# EAGLE design motherboard (EAGLE 9.1.3)
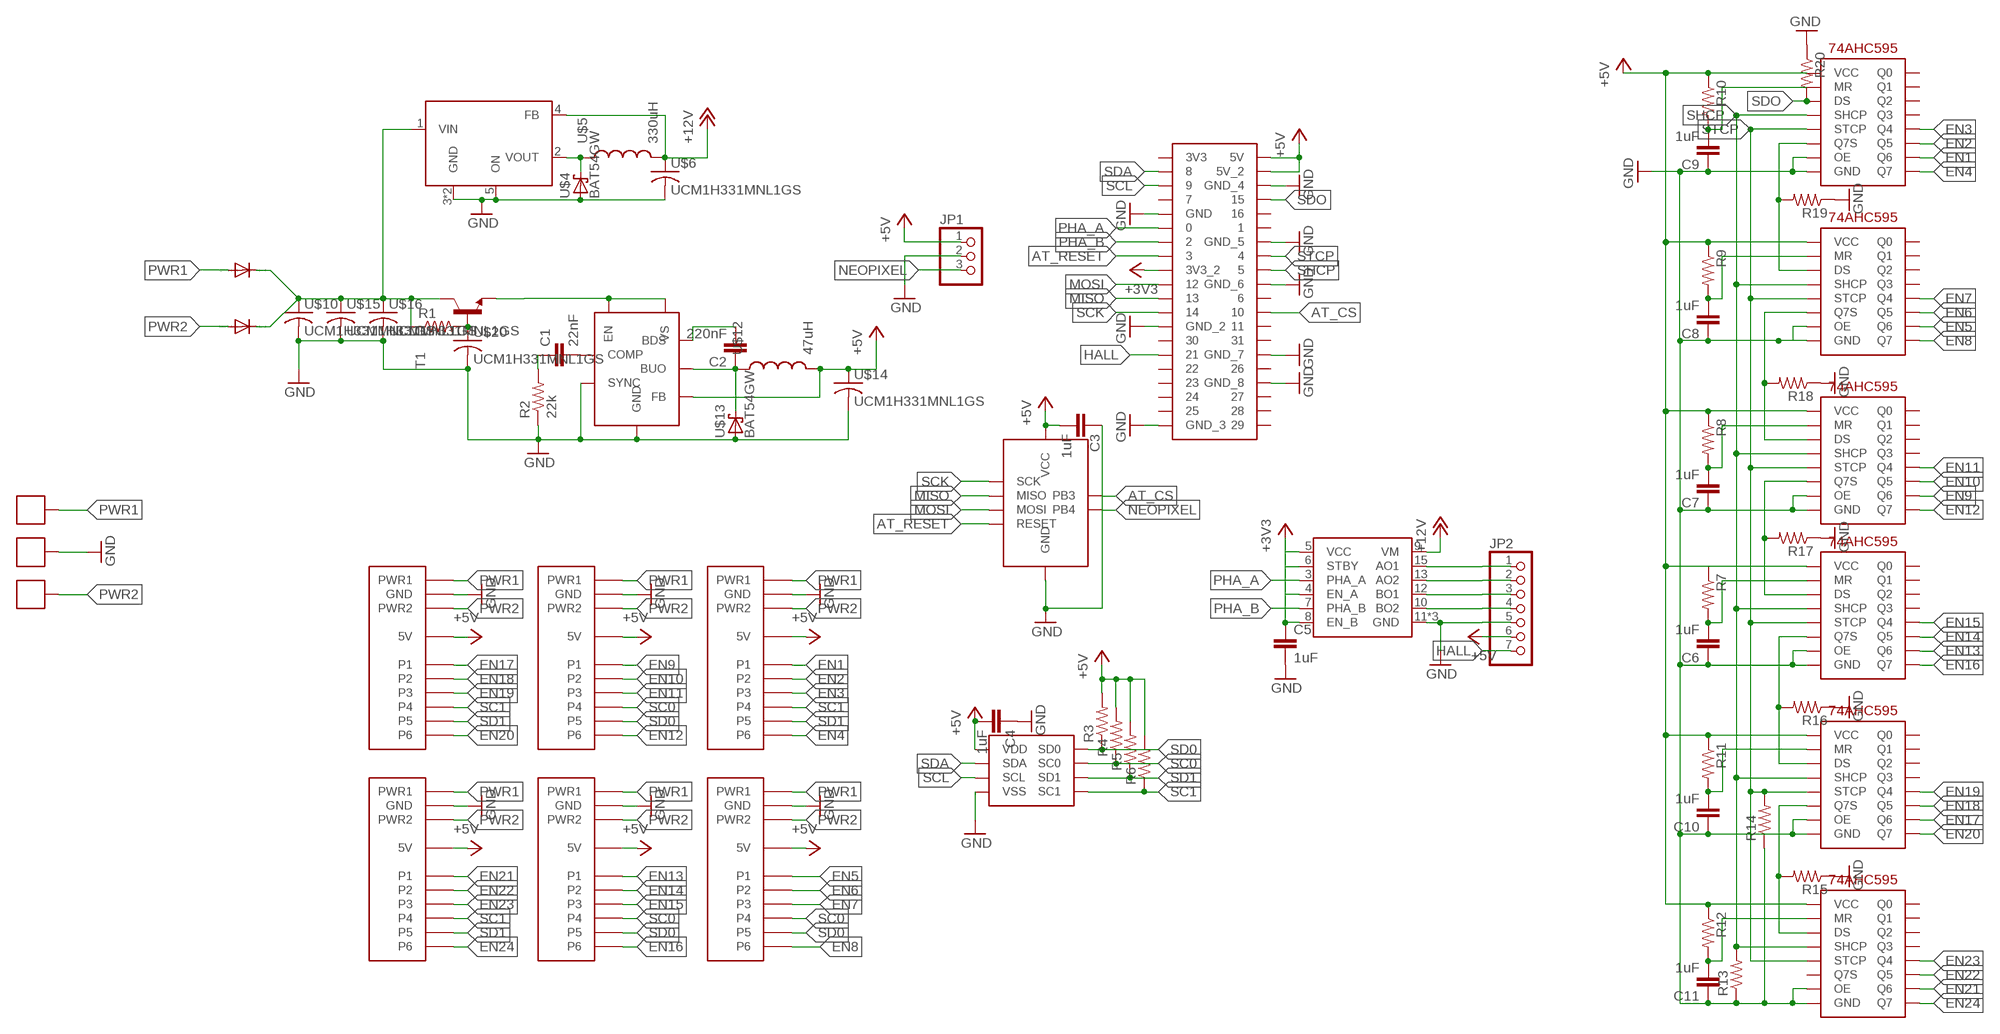
[diagram p0: schematic, sheet 1]

## Parts
B1  PCIE_SOCKET  [PCIE_SOCKET]
B2  PCIE_SOCKET  [PCIE_SOCKET]
B3  PCIE_SOCKET  [PCIE_SOCKET]
B4  PCIE_SOCKET  [PCIE_SOCKET]
B5  PCIE_SOCKET  [PCIE_SOCKET]
B6  PCIE_SOCKET  [PCIE_SOCKET]
C1  22nF  C-EUC0805  [C0805]
C2  220nF  C-EUC0805  [C0805]
C3  1uF  C-EUC0805  [C0805]
C4  1uF  C-EUC0805  [C0805]
C5  1uF  C-EUC0805  [C0805]
C6  1uF  C-EUC0805  [C0805]
C7  1uF  C-EUC0805  [C0805]
C8  1uF  C-EUC0805  [C0805]
C9  1uF  C-EUC0805  [C0805]
C10  1uF  C-EUC0805  [C0805]
C11  1uF  C-EUC0805  [C0805]
JP1  PINHD-1X3  [1X03]
JP2  PINHD-1X7  [1X07]
R1  R-US_R1206  [R1206]
R2  22k  R-US_R1206  [R1206]
R3  R-US_R0805  [R0805]
R4  R-US_R0805  [R0805]
R5  R-US_R0805  [R0805]
R6  R-US_R0805  [R0805]
R7  R-US_R0805  [R0805]
R8  R-US_R0805  [R0805]
R9  R-US_R0805  [R0805]
R10  R-US_R0805  [R0805]
R11  R-US_R0805  [R0805]
R12  R-US_R0805  [R0805]
R13  R-US_R0805  [R0805]
R14  R-US_R0805  [R0805]
R15  R-US_R0805  [R0805]
R16  R-US_R0805  [R0805]
R17  R-US_R0805  [R0805]
R18  R-US_R0805  [R0805]
R19  R-US_R0805  [R0805]
R20  R-US_R0805  [R0805]
T1  -NPN-SOT23-EBC  [SOT23-EBC]
U1  IFX91041EJV50XUMA1  [SOIC127P600X170-8]
U$1  RPI_SOCKET  [40PIN_SOCKET]
U$2  TC78H620FNG  [SSOP16]
U$3  TL2575HV-12IKTTR  [TO170P1524X483-6]
U$4  BAT54GW  [SOD3616X130]
U$5  330uH  SRN8040TA  [SRN8040TA]
U$6  UCM1H331MNL1GS  [CAPAE1030X1050]
U$7  74HC595_QFN  [QFN50P250X350X100-16]
U$8  BAS16GW  [SOD3616X130]
U$9  BAS16GW  [SOD3616X130]
U$10  UCM1H331MNL1GS  [CAPAE1030X1050]
U$11  ATTINY85  [SOIC127P599X175-8]
U$12  47uH  SRN8040TA  [SRN8040TA]
U$13  BAT54GW  [SOD3616X130]
U$14  UCM1H331MNL1GS  [CAPAE1030X1050]
U$15  UCM1H331MNL1GS  [CAPAE1030X1050]
U$16  UCM1H331MNL1GS  [CAPAE1030X1050]
U$17  1935310  [1935310]
U$18  1935310  [1935310]
U$19  1935310  [1935310]
U$20  UCM1H331MNL1GS  [CAPAE1030X1050]
U$21  PCA9540BDP  [TSSOP8]
U$22  74HC595_QFN  [QFN50P250X350X100-16]
U$23  74HC595_QFN  [QFN50P250X350X100-16]
U$24  74HC595_QFN  [QFN50P250X350X100-16]
U$25  74HC595_QFN  [QFN50P250X350X100-16]
U$26  74HC595_QFN  [QFN50P250X350X100-16]

## Nets
+3V3: C5.1 U$1.P17(3V3_2) U$2.4(EN_A) U$2.5(VCC) U$2.6(STBY) U$2.8(EN_B)
+5V: B1.5V_1(5V) B1.5V_2(5V) B2.5V_1(5V) B2.5V_2(5V) B3.5V_1(5V) B3.5V_2(5V) B4.5V_1(5V) B4.5V_2(5V) B5.5V_1(5V) B5.5V_2(5V) B6.5V_1(5V) B6.5V_2(5V) C3.2 C4.2 JP1.1 JP2.6 R3.2 R4.2 R5.2 R6.2 R7.1 R8.1 R9.1 R10.1 R11.1 R12.1 U1.4(FB) U$1.P2(5V) U$1.P4(5V_2) U$7.P16(VCC) U$11.8(VCC) U$12.P$2 U$14.1 U$21.3(VDD) U$22.P16(VCC) U$23.P16(VCC) U$24.P16(VCC) U$25.P16(VCC) U$26.P16(VCC)
+12V: U$2.9(VM) U$3.4(FB) U$5.P$2 U$6.1
AT_CS: U$1.P24 U$11.2(PB3)
AT_RESET: U$1.P15 U$11.1(RESET)
EN1: B1.P1 U$7.P6(Q6)
EN2: B1.P2 U$7.P5(Q5)
EN3: B1.P3 U$7.P4(Q4)
EN4: B1.P6 U$7.P7(Q7)
EN5: B2.P1 U$22.P6(Q6)
EN6: B2.P2 U$22.P5(Q5)
EN7: B2.P3 U$22.P4(Q4)
EN8: B2.P6 U$22.P7(Q7)
EN9: B3.P1 U$23.P6(Q6)
EN10: B3.P2 U$23.P5(Q5)
EN11: B3.P3 U$23.P4(Q4)
EN12: B3.P6 U$23.P7(Q7)
EN13: B4.P1 U$24.P6(Q6)
EN14: B4.P2 U$24.P5(Q5)
EN15: B4.P3 U$24.P4(Q4)
EN16: B4.P6 U$24.P7(Q7)
EN17: B5.P1 U$25.P6(Q6)
EN18: B5.P2 U$25.P5(Q5)
EN19: B5.P3 U$25.P4(Q4)
EN20: B5.P6 U$25.P7(Q7)
EN21: B6.P1 U$26.P6(Q6)
EN22: B6.P2 U$26.P5(Q5)
EN23: B6.P3 U$26.P4(Q4)
EN24: B6.P6 U$26.P7(Q7)
GND: B1.GND1(GND) B1.GND2(GND) B2.GND1(GND) B2.GND2(GND) B3.GND1(GND) B3.GND2(GND) B4.GND1(GND) B4.GND2(GND) B5.GND1(GND) B5.GND2(GND) B6.GND1(GND) B6.GND2(GND) C3.1 C4.1 C5.2 C6.1 C7.1 C8.1 C9.1 C10.1 C11.1 JP1.2 JP2.5 R2.1 R13.1 R14.1 R15.1 R16.1 R17.1 R18.1 R19.1 R20.1 U1.1(SYNC) U1.2(GND) U1.PAD(GND) U$1.P6(GND_4) U$1.P9(GND) U$1.P14(GND_5) U$1.P20(GND_6) U$1.P25(GND_2) U$1.P30(GND_7) U$1.P34(GND_8) U$1.P39(GND_3) U$2.11(GND) U$2.14(GND) U$2.16(GND) U$3.3(GND) U$3.5(ON) U$3.6(GND) U$4.2(A) U$6.2 U$7.P8(GND) U$7.P13(OE) U$7.P$1(GND) U$10.2 U$11.4(GND) U$13.2(A) U$14.2 U$15.2 U$16.2 U$18.P$1 U$18.P$2 U$20.2 U$21.6(VSS) U$22.P8(GND) U$22.P13(OE) U$22.P$1(GND) U$23.P8(GND) U$23.P13(OE) U$23.P$1(GND) U$24.P8(GND) U$24.P13(OE) U$24.P$1(GND) U$25.P8(GND) U$25.P13(OE) U$25.P$1(GND) U$26.P8(GND) U$26.P13(OE) U$26.P$1(GND)
HALL: JP2.7 U$1.P29
MISO: U$1.P21 U$11.6(MISO)
MOSI: U$1.P19 U$11.5(MOSI)
N$1: T1.E U1.7(EN) U1.8(VS)
N$2: R1.2 T1.B U$20.1
N$3: R1.1 T1.C U$3.1(VIN) U$8.1(C) U$9.1(C) U$10.1 U$15.1 U$16.1
N$4: C1.2 U1.3(COMP)
N$5: C1.1 R2.2
N$6: C2.2 U1.5(BDS)
N$7: C2.1 U1.6(BUO) U$12.P$1 U$13.1(C)
N$8: R19.2 U$7.P9(Q7S) U$22.P14(DS)
N$9: JP2.1 U$2.15(AO1)
N$10: JP2.2 U$2.13(AO2)
N$11: JP2.3 U$2.12(BO1)
N$12: JP2.4 U$2.10(BO2)
N$13: U$3.2(VOUT) U$4.1(C) U$5.P$1
N$14: C6.2 R7.2 U$24.P10(MR)
N$15: R18.2 U$22.P9(Q7S) U$23.P14(DS)
N$16: R17.2 U$23.P9(Q7S) U$24.P14(DS)
N$17: C7.2 R8.2 U$23.P10(MR)
N$18: C8.2 R9.2 U$22.P10(MR)
N$19: C9.2 R10.2 U$7.P10(MR)
N$20: R16.2 U$24.P9(Q7S) U$25.P14(DS)
N$21: C10.2 R11.2 U$25.P10(MR)
N$23: C11.2 R12.2 U$26.P10(MR)
N$24: R15.2 U$25.P9(Q7S) U$26.P14(DS)
NEOPIXEL: JP1.3 U$11.3(PB4)
PHA_A: U$1.P11 U$2.3(PHA_A)
PHA_B: U$1.P13 U$2.7(PHA_B)
PWR1: B1.PWR1_1(PWR1) B1.PWR1_2(PWR1) B2.PWR1_1(PWR1) B2.PWR1_2(PWR1) B3.PWR1_1(PWR1) B3.PWR1_2(PWR1) B4.PWR1_1(PWR1) B4.PWR1_2(PWR1) B5.PWR1_1(PWR1) B5.PWR1_2(PWR1) B6.PWR1_1(PWR1) B6.PWR1_2(PWR1) U$8.2(A) U$17.P$1 U$17.P$2
PWR2: B1.PWR2_1(PWR2) B1.PWR2_2(PWR2) B2.PWR2_1(PWR2) B2.PWR2_2(PWR2) B3.PWR2_1(PWR2) B3.PWR2_2(PWR2) B4.PWR2_1(PWR2) B4.PWR2_2(PWR2) B5.PWR2_1(PWR2) B5.PWR2_2(PWR2) B6.PWR2_1(PWR2) B6.PWR2_2(PWR2) U$9.2(A) U$19.P$1 U$19.P$2
SC0: B2.P4 B3.P4 B4.P4 R4.1 U$21.5(SC0)
SC1: B1.P4 B5.P4 B6.P4 R6.1 U$21.8(SC1)
SCK: U$1.P23 U$11.7(SCK)
SCL: U$1.P5 U$21.1(SCL)
SD0: B2.P5 B3.P5 B4.P5 R3.1 U$21.4(SD0)
SD1: B1.P5 B5.P5 B6.P5 R5.1 U$21.7(SD1)
SDA: U$1.P3 U$21.2(SDA)
SDO: R20.2 U$1.P8 U$7.P14(DS)
SHCP: R13.2 U$1.P18 U$7.P11(SHCP) U$22.P11(SHCP) U$23.P11(SHCP) U$24.P11(SHCP) U$25.P11(SHCP) U$26.P11(SHCP)
STCP: R14.2 U$1.P16 U$7.P12(STCP) U$22.P12(STCP) U$23.P12(STCP) U$24.P12(STCP) U$25.P12(STCP) U$26.P12(STCP)
Unconnected: U$1.P1(3V3) U$1.P7 U$1.P10 U$1.P12 U$1.P22 U$1.P26 U$1.P27 U$1.P28 U$1.P31 U$1.P32 U$1.P33 U$1.P35 U$1.P36 U$1.P37 U$1.P38 U$1.P40 U$7.P1(Q1) U$7.P2(Q2) U$7.P3(Q3) U$7.P15(Q0) U$22.P1(Q1) U$22.P2(Q2) U$22.P3(Q3) U$22.P15(Q0) U$23.P1(Q1) U$23.P2(Q2) U$23.P3(Q3) U$23.P15(Q0) U$24.P1(Q1) U$24.P2(Q2) U$24.P3(Q3) U$24.P15(Q0) U$25.P1(Q1) U$25.P2(Q2) U$25.P3(Q3) U$25.P15(Q0) U$26.P1(Q1) U$26.P2(Q2) U$26.P3(Q3) U$26.P9(Q7S) U$26.P15(Q0)

## Library data of the parts
B1-B6 = tide_clock:PCIE_SOCKET
C1-C11 = resistor:C-EU: CAPACITOR, European symbol
JP1 = pinhead:PINHD-1X3: PIN HEADER
JP2 = pinhead:PINHD-1X7: PIN HEADER
R1-R20 = resistor:R-US_: RESISTOR, American symbol
T1 = transistor:*-NPN-: NPN Transistror BF959 corrected 2008.03.06
U1 = tide_clock:IFX91041EJV50XUMA1
U$1 = tide_clock:RPI_SOCKET
U$2 = tide_clock:TC78H620FNG
U$3 = tide_clock:TL2575HV-12IKTTR
U$4 U$13 = tide_clock:BAT54GW
U$5 U$12 = tide_clock:SRN8040TA
U$6 U$10 U$14-U$16 U$20 = tide_clock:UCM1H331MNL1GS
U$7 U$22-U$26 = tide_clock:74HC595_QFN
U$8 U$9 = tide_clock:BAS16GW
U$11 = tide_clock:ATTINY85
U$17-U$19 = tide_clock:1935310
U$21 = tide_clock:PCA9540BDP

## Board
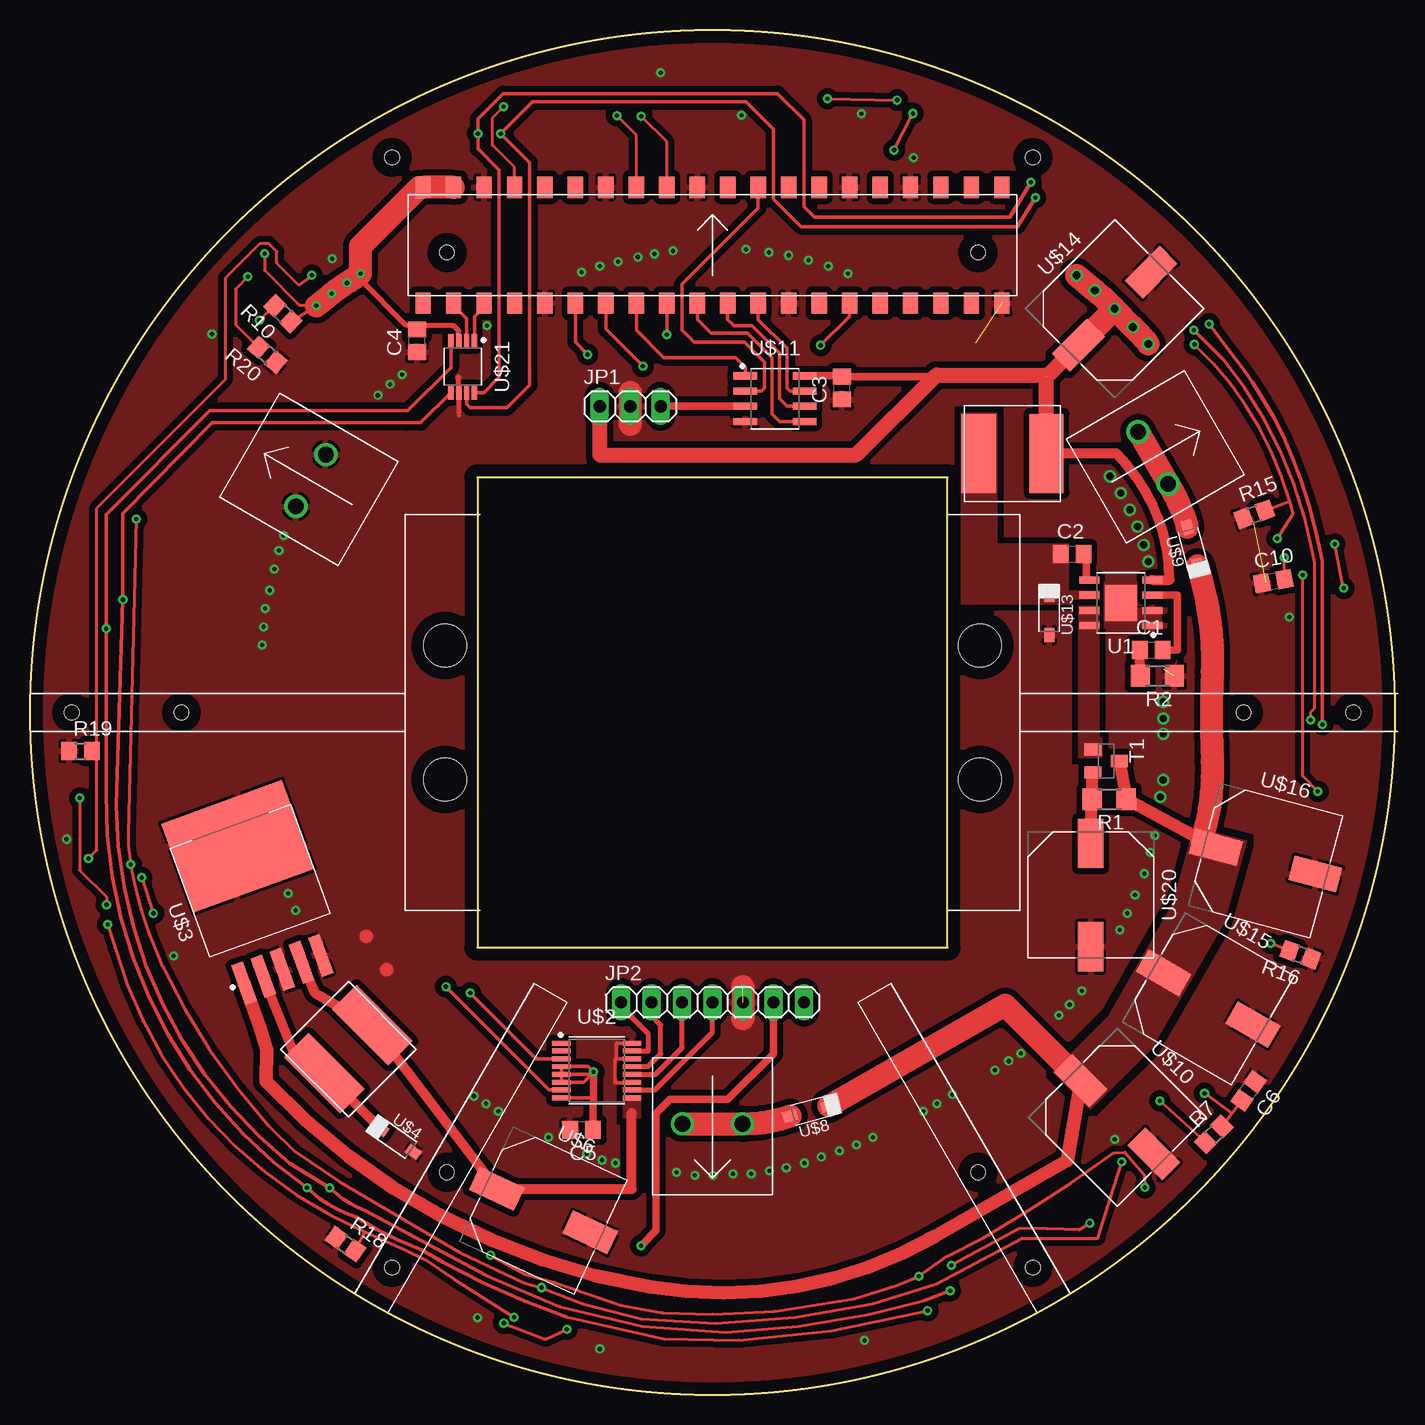
[diagram p1: board, top side]
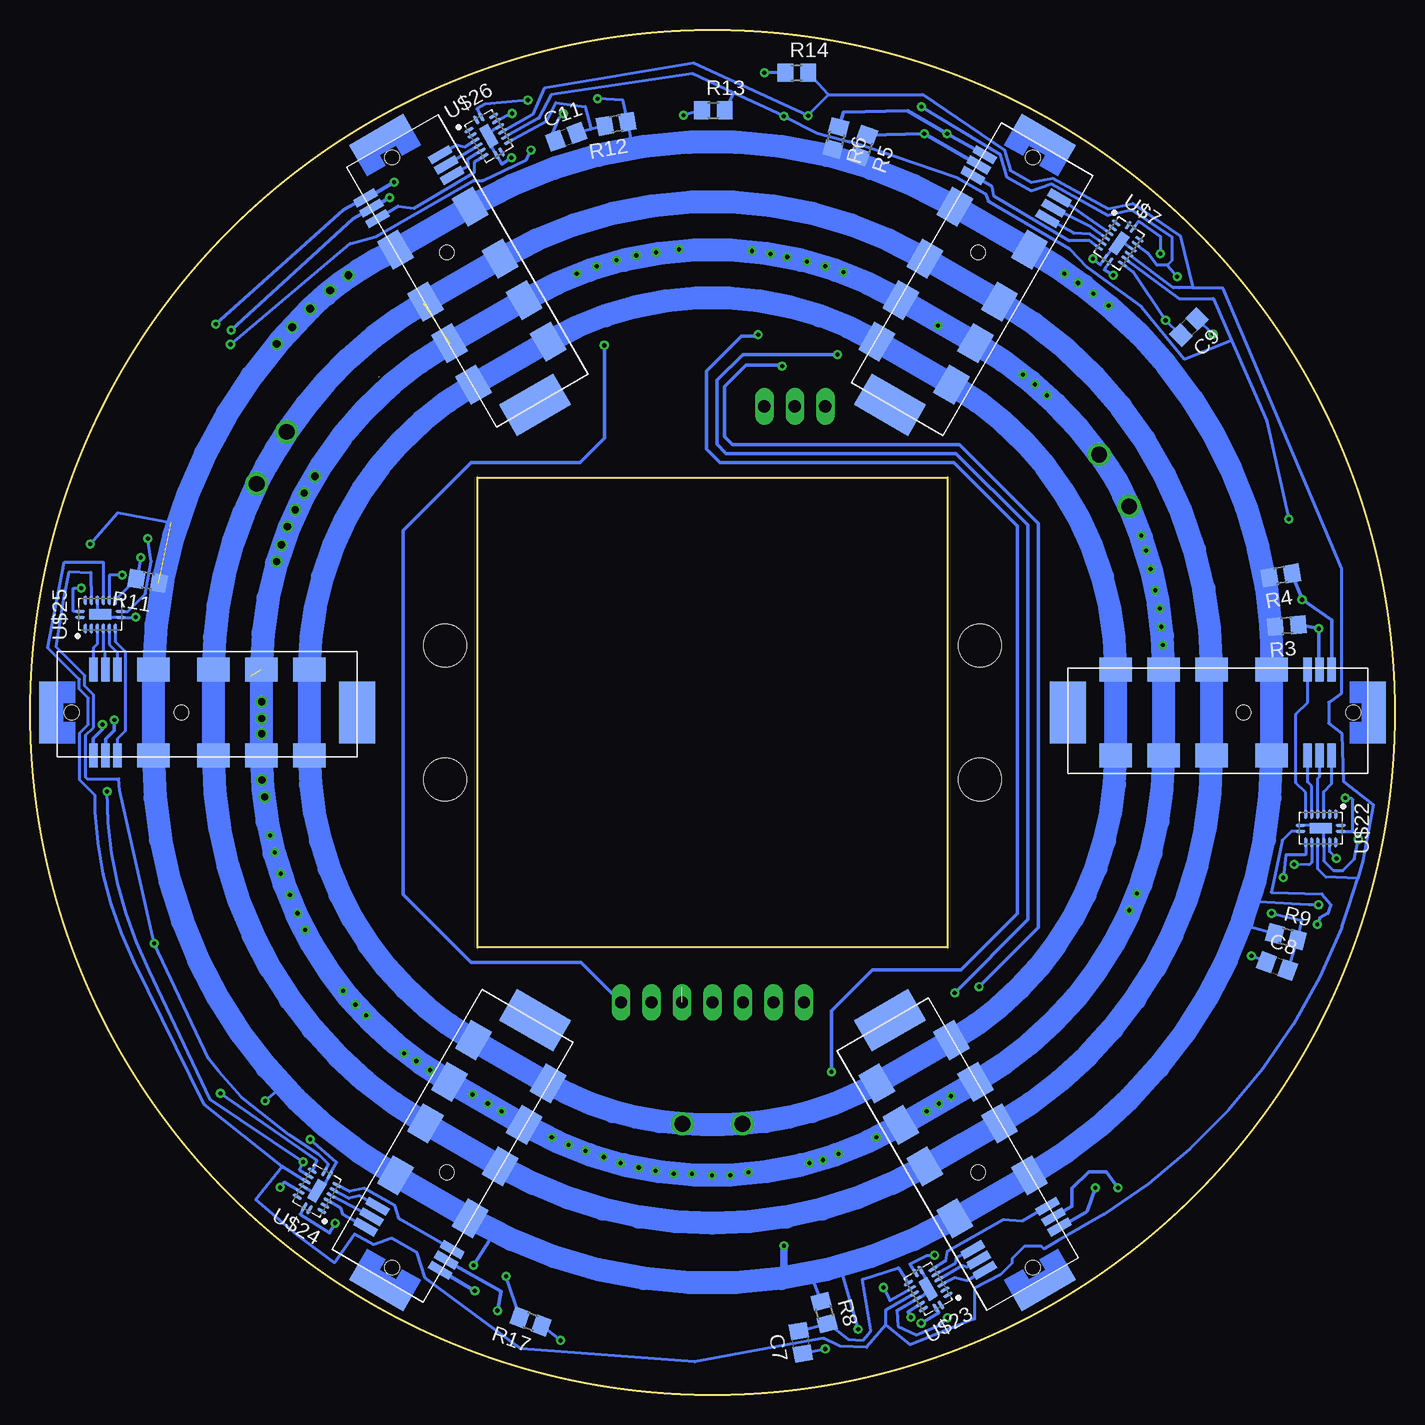
[diagram p2: board, bottom side, seen from below]

Size 113.79 x 113.79 mm. Coordinates in mm from the lower left corner, seen from the top.
Outline: 37.3,37.3 76.49,37.3 76.49,76.49 37.3,76.49 37.3,37.3
Outline: circle at 56.9,56.9 radius 56.9
Copper layers (1*16): Top 0.035mm / dielectric 1.5mm / Bottom 0.035mm
Design rules "default": minimum track width 6mil, minimum drill 0.35mm, track to track 6mil, track to pad 6mil, pad to pad 6mil, via to via 6mil, smd to smd 6mil, copper to edge 40mil, drill to drill 6mil, minimum pad ring 10mil, minimum via ring 8mil, stop-mask expansion 4mil, vias tented up to drill 0mil, thermal gap 10mil
Holes 3.56 mm at 79.19,51.32 79.19,62.47 34.6,51.32 34.6,62.47

### Footprints (pad centres in the part's own frame; a part is rotated, then mirrored left to right if it is on the bottom)
PCIE_SOCKET = smd 2.7 x 2: 5V_1 2.5,-3.6; 5V_2 2.5,3.6; GND1 -6.5,3.6; GND2 -6.5,-3.6; PWR1_1 -10.5,3.6; PWR1_2 -10.5,-3.6; PWR2_1 -2.5,3.6; PWR2_2 -2.5,-3.6 | smd 3 x 5.2: LEFT_TAB -14.5,0 | smd 0.7 x 2: P1 5.5,-3.6; P2 6.5,-3.6; P3 7.5,-3.6; P4 7.5,3.6; P5 6.5,3.6; P6 5.5,3.6 | smd 1.5 x 5.2: RIGHT_TAB 11.25,0 | hole 1.2: 0.15,0; 9.3,0
C0805 = smd 1.3 x 1.5: 1 -0.95,0; 2 0.95,0
1X03 = drill 1.016 long: 1 -2.54,0; 2 0,0; 3 2.54,0
1X07 = drill 1.016 long: 1 -7.62,0; 2 -5.08,0; 3 -2.54,0; 4 0,0; 5 2.54,0; 6 5.08,0; 7 7.62,0
R1206 = smd 1.6 x 1.803: 1 -1.422,0; 2 1.422,0
R0805 = smd 1.3 x 1.5: 1 -0.95,0; 2 0.95,0
SOT23-EBC = smd 1 x 1.4: B 0.95,-1.1; C 0,1.1; E -0.95,-1.1
SOIC127P600X170-8 = smd 1.655 x 0.592: 1 -2.63,1.905; 2 -2.63,0.635; 3 -2.63,-0.635; 4 -2.63,-1.905; 5 2.63,-1.905; 6 2.63,-0.635; 7 2.63,0.635; 8 2.63,1.905 | smd 2.65 x 3: PAD 0,0
40PIN_SOCKET = smd 1.27 x 1.78: P1 -24.13,-4.825; P2 -24.13,4.825; P3 -21.59,-4.825; P4 -21.59,4.825; P5 -19.05,-4.825; P6 -19.05,4.825; P7 -16.51,-4.825; P8 -16.51,4.825; P9 -13.97,-4.825; P10 -13.97,4.825; P11 -11.43,-4.825; P12 -11.43,4.825; P13 -8.89,-4.825; P14 -8.89,4.825; P15 -6.35,-4.825; P16 -6.35,4.825; P17 -3.81,-4.825; P18 -3.81,4.825; P19 -1.27,-4.825; P20 -1.27,4.825; P21 1.27,-4.825; P22 1.27,4.825; P23 3.81,-4.825; P24 3.81,4.825; P25 6.35,-4.825; P26 6.35,4.825; P27 8.89,-4.825; P28 8.89,4.825; P29 11.43,-4.825; P30 11.43,4.825; P31 13.97,-4.825; P32 13.97,4.825; P33 16.51,-4.825; P34 16.51,4.825; P35 19.05,-4.825; P36 19.05,4.825; P37 21.59,-4.825; P38 21.59,4.825; P39 24.13,-4.825; P40 24.13,4.825
SSOP16 = smd 1.515 x 0.409: 1 -2.948,2.275; 2 -2.948,1.625; 3 -2.948,0.975; 4 -2.948,0.325; 5 -2.948,-0.325; 6 -2.948,-0.975; 7 -2.948,-1.625; 8 -2.948,-2.275; 9 2.948,-2.275; 10 2.948,-1.625; 11 2.948,-0.975; 12 2.948,-0.325; 13 2.948,0.325; 14 2.948,0.975; 15 2.948,1.625; 16 2.948,2.275
TO170P1524X483-6 = smd 3.469 x 0.994: 1 -6.558,3.4; 2 -6.558,1.7; 3 -6.558,0; 4 -6.558,-1.7; 5 -6.558,-3.4 | smd 7.885 x 10.7: 6 4.35,0
SOD3616X130 = smd 1.159 x 0.839: 1 -1.656,0; 2 1.656,0
SRN8040TA = smd 6.6 x 2.85: P$1 0,2.825; P$2 0,-2.825
CAPAE1030X1050 = smd 4.11 x 2.12: 1 -4.299,0; 2 4.299,0
QFN50P250X350X100-16 = smd 0.264 x 0.86: P1 -0.25,1.685; P8 -0.25,-1.685; P9 0.25,-1.685; P16 0.25,1.685 | smd 0.86 x 0.264: P2 -1.185,1.25; P3 -1.185,0.75; P4 -1.185,0.25; P5 -1.185,-0.25; P6 -1.185,-0.75; P7 -1.185,-1.25; P10 1.185,-1.25; P11 1.185,-0.75; P12 1.185,-0.25; P13 1.185,0.25; P14 1.185,0.75; P15 1.185,1.25 | smd 0.85 x 1.85: P$1 0,0
SOIC127P599X175-8 = smd 1.972 x 0.599: 1 -2.472,1.905; 2 -2.472,0.635; 3 -2.472,-0.635; 4 -2.472,-1.905; 5 2.472,-1.905; 6 2.472,-0.635; 7 2.472,0.635; 8 2.472,1.905
1935310 = drill 1.3: P$1 2.5,0; P$2 -2.5,0
TSSOP8 = smd 1.15 x 0.45: 1 -2.153,0.975; 2 -2.153,0.325; 3 -2.153,-0.325; 4 -2.153,-0.975; 5 2.153,-0.975; 6 2.153,-0.325; 7 2.153,0.325; 8 2.153,0.975

### Placement (x,y rotation side)
B1  34.84,95.1 60 bottom
B2  12.78,56.9 0 bottom
B3  34.84,18.69 300 bottom
B4  78.95,18.69 240 bottom
B5  101.01,56.9 180 bottom
B6  78.95,95.1 120 bottom
C1  93.47,62.1 0 top
C2  86.87,70.1 0 top
C3  67.69,83.95 90 top
C4  32.26,87.88 90 top
C5  45.97,22.1 180 top
C6  101.57,25.35 235 top
C7  49.53,4.39 100 bottom
C8  9.83,35.76 340 bottom
C9  17.17,89.03 225 bottom
C10  103.63,67.84 10 top
C11  69.09,104.88 20 bottom
JP1  50.04,82.42 0 top
JP2  56.9,32.73 0 top
R1  89.96,49.67 180 top
R2  93.98,59.94 180 top
R3  9.02,64.14 185 bottom
R4  9.53,68.33 190 bottom
R5  44.32,104.14 250 bottom
R6  46.61,104.78 255 bottom
R7  98.68,21.72 45 top
R8  47.57,6.88 285 bottom
R9  9.09,38.2 345 bottom
R10  21.08,90.14 135 top
R11  103.99,67.87 170 bottom
R12  64.92,105.97 190 bottom
R13  56.82,107.09 0 bottom
R14  49.86,110.24 0 bottom
R15  102.06,73.41 20 top
R16  105.89,36.7 160 top
R17  72.06,6.12 160 bottom
R18  26.31,12.57 325 top
R19  4.22,53.67 0 top
R20  19.79,86.72 140 top
T1  89.71,52.85 270 top
U1  90.93,66.04 180 top
U$1  56.9,95.85 0 top
U$2  47.24,27.05 0 top
U$3  18.8,41.66 110 top
U$4  30.61,21.21 325 top
U$5  26.54,28.83 135 top
U$6  42.8,15.37 335 top
U$7  23,96 325 bottom
U$8  64.97,23.68 195 top
U$9  96.91,70.73 105 top
U$10  90.64,23.15 315 top
U$11  62.1,83.06 0 top
U$12  81.92,78.49 90 top
U$13  84.96,65.02 270 top
U$14  90.42,90.55 45 top
U$15  98.23,33.03 330 top
U$16  103,44.54 345 top
U$17  56.9,22.6 0 top
U$18  23.4,76.23 240 top
U$19  93.64,78.11 120 top
U$20  88.42,41.68 270 top
U$21  36.07,85.72 270 top
U$22  6.2,47.24 270 bottom
U$23  38.91,8.84 210 bottom
U$24  89.87,17.02 150 bottom
U$25  107.92,65.07 90 bottom
U$26  75.54,104.95 30 bottom

### Tracks (layer width: path | path; a pad name or v marks a point on that pad's centre or on a via)
+3V3  (via drill 0.35)
  Top 0.305: U$2.5 U$2.4 46.54,27.38 v46.99,26.92 | U$2.5 U$2.6 46.14,26.08 v46.99,26.92 | U$1.P17 v53.09,88.39 | v46.99,26.92 46.79,26.73 U$2.5 | U$2.8 46.99,24.78 v46.99,26.92
  Top 0.61: C5.1 v46.99,26.92
  Bottom 0.305: v53.09,88.39 53.21,88.27 54.48,88.27 57.4,85.34 57.4,78.87 56.27,77.73 36.78,77.73 31.5,72.44 31.5,40.13 36.2,35.43 43.56,35.43 46.99,32 v46.99,26.92
+5V  (via drill 0.35, 0.65)  (2 unrouted)
  Top 0.254: v19.56,95.15 19.56,93.75 22.45,90.86 24.18,90.86 v25.15,91.82 | v4.14,49.76 4.14,46.3 4.14,43.74 6.38,41.5 v6.38,40.87 | v39.5,5.99 42.98,4.65 v44.76,5.49 | R10.1 v23.88,90.81 | v88.34,14.33 87.46,13.76 84.84,13.84 82.5,13.91 v76.81,10.82 | R7.1 v94.18,24.51 | v109.53,67.26 109.5,67.26 v108.76,70.94 | v66.47,108.05 v72.29,107.95
  Top 0.305: 27.56,92.96 v27.56,93.47
  Top 0.406: U$21.3 35.74,88.72 35.31,89.15 32.58,89.15 C4.2 31.94,89.15 31.37,89.15 27.56,92.96
  Top 0.61: 84.58,85.03 84.74,84.87 84.74,85.03 | U$11.8 67.69,84.96 C3.2 84.65,84.9 84.74,84.89 | JP2.6 61.98,28.45 58.17,24.64 53.34,24.64 52.2,23.5 52.2,13.72 v50.93,12.45
  Top 0.813: U$12.P$2 90.55,78.49 arc-46 95,67.94 U1.4
  Top 1.27: U$12.P$2 84.74,84.89 | 84.74,84.87 U$14.1 | JP1.1 47.5,78.36 68.83,78.36 75.56,85.03 84.74,85.03
  Top 1.905: U$14.1 v90.42,90.55 | v87.25,93.34 v88.77,92.08 arc-6 v90.42,90.55 | v90.42,90.55 v91.95,89.03 arc-5 v93.22,87.63 | U$1.P4 U$1.P2 32.47,100.67 27.56,95.76 v27.56,93.47 arc-5 v26.42,92.71 arc7 v25.15,91.82 v23.88,90.81
  Bottom 0.254: U$7.P16 21.41,97.84 19.56,96.57 v19.56,95.15 | U$22.P16 3.51,46.99 3.5,47 3.5,49.63 3.63,49.76 v4.14,49.76 | 11.41,41.1 7.19,40.87 v6.38,40.87 | 11.41,41.1 10.65,52.92 B2.5V_1 | U$23.P16 38.02,6.83 v39.5,5.99 | v44.76,5.49 46.05,9.98 B3.5V_1 | R9.1 12.14,39.04 11.41,41.1 | R8.1 48.46,9.53 48.76,10.54 | v76.81,10.82 75.49,12.88 B4.5V_2 | U$24.P16 90.94,15.67 91.29,15.07 88.8,13.51 v88.34,14.33 | v94.18,24.51 93.24,25.3 B4.5V_1 | U$25.P16 110.19,65.33 110.19,67.26 v109.53,67.26 | v108.76,70.94 106.49,73.55 102.01,72.72 | B5.5V_1 R11.1 | B6.5V_1 63.73,104.72 R12.1 64.36,107.95 v66.47,108.05 | v72.29,107.95 75.84,107.62 76.53,107.21 U$26.P16
  Bottom 0.305: 22.39,89.31 v23.88,90.81 | R4.2 R3.2 B2.5V_2 | R6.2 R5.2 B1.5V_2
  Bottom 0.61: v50.93,12.45 50.93,9.91 48.76,10.54 37.6,13.82 B3.5V_1
  Bottom 1.905: B1.5V_2 B1.5V_1 arc11 v23.88,90.81 arc51 B2.5V_2 B2.5V_1 arc60 B3.5V_2 B3.5V_1 arc60 B4.5V_2 B4.5V_1 arc60 B5.5V_2 B5.5V_1 arc45 v90.42,90.55 arc19 B6.5V_2 B6.5V_1 arc60 B1.5V_2 | B1.5V_2 arc-60 B1.5V_2
+12V
  Top 0.813: 50.16,23.5 50.16,17.18 U$6.1 U$5.P$2 23.75,33.53 U$3.4
  pour Top (no thermals): 49.43,24.99 50.95,24.99 50.95,23.06 49.43,23.06
AT_CS
  Top 0.305: U$11.2 60.96,83.69 61.21,83.95 61.21,86.11 59.56,87.76 55.37,87.76 54.36,88.77 54.36,92.58 60.7,98.93 U$1.P24
AT_RESET
  Top 0.305: U$1.P15 50.55,88.77 52.83,86.49 58.8,86.49 59.63,85.66 U$11.1
EN1
  Bottom 0.254: U$7.P6 25.4,96.77 26.77,96.85 B1.P1
EN2
  Bottom 0.254: U$7.P5 25.32,97.36 B1.P2
EN3
  Bottom 0.254: U$7.P4 26.01,98.42 B1.P3
EN4
  Bottom 0.254: U$7.P7 25.43,96.22 27.17,96.22 33.42,99.96 33.58,100.71 B1.P6
EN5
  Bottom 0.254: U$22.P6 6.95,50.76 7.28,51.09 B2.P1
EN6
  Bottom 0.254: U$22.P5 6.45,51.39 6.28,51.56 B2.P2
EN7
  Bottom 0.254: U$22.P4 5.95,50.29 5.28,50.96 B2.P3
EN8
  Bottom 0.254: U$22.P7 7.45,50.22 8.26,51.03 8.26,56.77 7.28,57.75 B2.P6
EN9
  Bottom 0.254: B3.P1 36.58,11.43 36.7,10.92 U$23.P6
EN10
  Bottom 0.254: U$23.P5 36.07,10.79 35.69,10.67 B3.P2
EN11
  Bottom 0.254: B3.P3 35.69,9.53 36.7,9.78 U$23.P4
EN12
  Bottom 0.254: B3.P6 31.11,14.48 32.64,14.61 37.34,11.94 37.47,11.18 U$23.P7
EN13
  Bottom 0.254: B4.P1 86.33,16.61 87.22,16.38 U$24.P6
EN14
  Bottom 0.254: B4.P2 U$24.P5
EN15
  Bottom 0.254: B4.P3 87.68,15.04 87.86,15.54 U$24.P4
EN16
  Bottom 0.254: B4.P6 83.01,14.68 83.36,15.77 85.95,17.22 87.17,16.97 U$24.P7
EN17
  Bottom 0.254: U$25.P6 107.17,62.57 106.51,61.91 B5.P1
EN18
  Bottom 0.254: U$25.P5 107.67,62.06 107.54,61.92 107.54,60.52 B5.P2
EN19
  Bottom 0.254: U$25.P4 108.17,62.62 108.51,62.28 B5.P3
EN20
  Bottom 0.254: U$25.P7 106.67,62.81 105.84,61.98 105.84,55.37 106.51,54.7 B5.P6
EN21
  Bottom 0.254: U$26.P6 77.32,103.02 77.27,102.44 B6.P1
EN22
  Bottom 0.254: U$26.P5 B6.P2
EN23
  Bottom 0.254: U$26.P4 77.55,104.04 78.23,104.17 B6.P3
EN24
  Bottom 0.254: B6.P6 83.08,99.11 81.79,98.93 76.73,101.93 76.71,102.79 U$26.P7
GND  (via drill 0.35, 0.6)  (3 unrouted)
  Top 0.305: 35.74,81.66 35.81,81.66 | 48.77,26.04 48.77,26.08 | U$2.16 48.9,29.33 48.9,28.03 | 48.9,28.03 U$2.14 | U$2.11 50.15,26.04 48.77,26.04 | 48.9,28.03 48.77,28.03 48.77,26.04
  Top 0.406: 35.74,81.92 U$21.6 35.74,84.84 35.69,84.84
  Top 1.143: 28.04,38.23 28.07,38.23 | 29.72,35.48 29.72,35.43
  Top 1.905: 50.04,83.57 50.04,80.9 | 59.44,34.04 59.44,31.37
  Bottom 0.254: v25.2,94.72 25.12,94.64 24.55,94.23 U$7.P8 23.67,95.45 U$7.P$1 22.55,96.01 U$7.P13 | v3.05,46.33 3.38,44.68 4.34,43.71 5.13,43.71 5.95,44.53 U$22.P13 5.95,46.99 U$22.P$1 6.45,47.49 U$22.P8 | U$23.P8 39.12,9.65 U$23.P$1 39.29,8.33 U$23.P13 41.53,7.04 41.43,5.74 39.9,5 37.9,5.84 v37.31,6.45 | C9.1 v15.16,88.44 | C8.1 v11.96,36.6 | v31.01,85.06 B1.GND2 | C7.1 v47.5,3.83 | 89.79,17.08 89.28,17.5 U$24.P8 88.21,19.38 v90.42,21.31 | 89.79,17.08 U$24.P$1 | U$24.P13 90.4,17.02 89.79,17.08 | 107.92,65 107.92,64.83 U$25.P8 104.98,64.83 v104.98,64.85 | 107.92,65 U$25.P$1 | U$25.P13 108.17,65 107.92,65 | v69.32,106.81 69.69,106.44 70.21,105.17 70.21,104.78 C11.1 | U$26.P13 75.26,105.39 U$26.P$1 75.51,104.44 U$26.P8 74.5,102.62 v73.66,103.15 | R17.1 v69.57,4.55 | R13.1 v59.31,106.68 | R14.1 v52.58,110.24
  Bottom 1.905: B2.GND2 B2.GND1 arc-24 U$18.P$1 arc-12 U$18.P$2 arc-24 B1.GND2 B1.GND1 arc-60 B6.GND2 B6.GND1 arc-60 B5.GND2 B5.GND1 arc-60 B4.GND2 B4.GND1 arc-60 B3.GND2 B3.GND1 arc-60 B2.GND2
  other vias: 90.04,76.58 90.93,75.18 91.69,73.79 92.33,72.39 92.84,70.87 93.22,69.47 94.49,57.78 94.49,56.39 94.49,55.12 47.5,94.11 49.02,94.49 50.67,94.87 52.07,95.12 53.59,95.38 45.97,93.6 59.69,95.5 61.59,95.25 63.25,95 64.9,94.61 66.55,94.11 68.2,93.47 38.1,89.15 30.02,84.25 29.01,83.34 94.46,51.26 94.23,49.86 21.13,71.65 20.75,70.38 20.37,68.86 19.99,67.08 19.61,65.56 19.48,64.03 19.35,62.51 21.51,41.81 22.15,40.41 37.01,24.92 38.02,24.28 39.04,23.65 43.23,21.49 46.41,20.09 47.68,19.58 48.82,19.33 53.9,18.57 55.42,18.31 56.95,18.31 58.6,18.44 60.12,18.44 61.65,18.69 63.04,18.95 64.57,19.33 65.96,19.84 67.49,20.35 68.88,20.85 70.28,21.49 74.47,23.65 75.62,24.28 76.89,25.04 80.44,27.08 81.58,27.84 82.6,28.47 85.78,31.65 86.66,32.54 87.68,33.68 90.86,38.76 91.49,40.16 92.13,41.68 92.89,43.46 93.4,45.24 93.78,46.63
  pour Top (isolate 0.508, rank 5): 0,0 113.79,0 113.79,113.79 0,113.79
  pour Top (no thermals): 89.53,67.82 92.33,67.82 92.33,65.66 94.36,65.66 94.36,63.88 89.53,63.88
HALL  (via drill 0.35)
  Top 0.305: v65.91,87.5 68.33,89.92 U$1.P29
  Bottom 0.305: JP2.7 67.84,36.06 77,36.06 82.68,41.73 82.68,72.06 77,77.73 67.94,77.73 65.91,79.77 v65.91,87.5
MISO
  Top 0.305: U$1.P21 58.17,89.66 58.67,89.15 60.2,89.15 62.48,86.87 62.48,83.06 63.12,82.42 U$11.6
MOSI
  Top 0.305: U$1.P19 55.62,89.66 56.77,88.52 59.82,88.52 61.85,86.49 61.85,81.79 62.48,81.15 U$11.5
N$1
  pour Top (no thermals): 87.38,65.79 89.15,65.79 89.15,54.86 89.41,54.86 89.41,53.09 88.01,53.09 87.38,53.09
N$2
  Top 1.016: U$20.1 R1.2 T1.B
N$3
  Top 1.016: T1.C R1.1 U$16.1
  Top 1.143: U$10.1 87.6,26.16 86.49,19.56 75.44,13.21 arc-39 51.69,9.02 arc-38 19.68,26.16 19.71,28.8 19.18,30.61 U$3.1
  Top 1.905: U$8.1 81.28,32.51 U$10.1 | U$9.1 97.66,67.94 arc-17 98.55,60.33 arc4 98.55,52.83 arc-19 97.68,46.28
  pour Top (no thermals): 85.22,26.92 88.39,23.75 93.47,28.83 99.57,39.37 101.47,46.23 97.03,47.37 95.25,41.02 89.92,31.62
N$4
  Top 0.61: U1.3 95.63,66.67 95.63,62.1 C1.2
N$5
  Top 0.813: R2.2 C1.1
N$6
  Top 0.61: U1.5 88.07,68.17 88.07,69.85 C2.2
N$7
  Top 0.61: U1.6
  pour Top (no thermals): 89.15,67.06 89.15,66.29 86.87,66.29 86.87,65.91 77.6,65.91 77.6,74.93 77.6,81.92 80.64,81.92 80.64,70.99 86.61,70.99 86.61,67.06
N$8  (via drill 0.35)
  Top 0.254: v23.5,93.34 23.39,93.24 22.4,92.53 20.57,94.36 20.57,95.33 19.91,95.99 19.15,95.99 16.28,93.12 16.28,84.66 5.56,73.94 5.56,53.67 | v4.88,44.73 5.56,45.41 5.56,53.67 | 5.56,53.67 R19.2 5.56,53.67
  Bottom 0.254: U$7.P9 24.23,93.8 v23.5,93.34 | v4.88,44.73 5.45,45.3 U$22.P14
N$9
  Top 0.406: U$2.15 51.56,28.68 51.56,30.1 49.27,32.39 JP2.1
N$10
  Top 0.406: U$2.13 51.51,27.38 52.58,28.45 52.58,30.86 51.81,31.62 JP2.2
N$11
  Top 0.406: U$2.12 52.13,26.73 54.35,28.95 JP2.3
N$12
  Top 0.406: U$2.10 52.1,25.43 56.9,30.23 JP2.4
N$13
  Top 0.813: U$3.2 21.97,28.57 U$5.P$1 U$4.1
N$14  (via drill 0.35)
  Top 0.254: R7.2 100.2,23.49 | 100.2,23.49 C6.2 | v97.92,25.15 100.2,23.49
  Bottom 0.254: v97.92,25.15 89.89,19.56 U$24.P10
N$15  (via drill 0.35)
  Top 0.254: v6.48,39.22 6.81,38.15 7.09,37.26 arc51 27.94,13.59 | 27.94,13.59 arc-2 32.89,11.3 arc3 v40.36,6.48 | R18.2 27.94,13.59
  Bottom 0.254: U$22.P9 8.63,46.99 9.4,46.23 10.31,41.91 6.1,41.78 5.33,40.89 5.59,40.13 6.27,39.78 v6.48,39.22 | v40.36,6.48 40.62,6.93 U$23.P14
N$16  (via drill 0.35)
  Top 0.254: v38.38,11.66 41.27,10.06 43.69,9.4 49.28,7.49 52.7,6.86 56.9,6.73 62.1,6.99 68.71,8 72.26,9.14 v74.09,9.91 76.45,11.56 79.48,13.11 arc6 90.36,20.18 91.28,20.23 92.89,18.36 v92.94,17.3
  Bottom 0.254: U$23.P9 40.44,10.92 39.01,11.63 v38.38,11.66 | v92.94,17.3 92.58,17.75 U$24.P14 | R17.2 v74.09,9.91
N$17
  Bottom 0.254: C7.2 R8.2 45.62,4.65 44.35,4.57 43.69,5.36 44.37,9.65 41.4,10.62 U$23.P10
N$18  (via drill 0.35)
  Top 0.254: v9.32,43.13 v10.29,40.16
  Bottom 0.254: U$22.P10 7.45,45.03 9.09,45.03 v9.32,43.13 | v10.29,40.16 7.77,39.55 R9.2 C8.2
N$19  (via drill 0.35)
  Top 0.254: v19.13,89.59 R10.2
  Bottom 0.254: C9.2 v19.13,89.59 21.87,93.65 U$7.P10
N$20  (via drill 0.35)
  Top 0.254: R16.2 v103.43,37.64
  Bottom 0.254: U$24.P9 88.9,19.23 89.71,20.04 92.18,21.69 96.14,24.79 98.06,26.99 | U$25.P14 108.71,68.58 110.5,68.63 111,66.29 111.58,62.33 109.22,59.97 109.22,59.11 108.48,58.37 108.48,55.65 109.17,54.97 109.17,51.51 109.02,51.36 106.38,51.36 106.32,50.39 v103.43,37.64 98.89,28.02 | 98.06,26.99 | 98.06,26.99 98.89,28.02 | 98.89,28.02 98.91,28.04
N$21  (via drill 0.35)
  Top 0.254: v104.57,69.8 104.59,68.03 C10.2
  Bottom 0.254: v104.57,69.8 104.87,68.09 R11.2 106.6,66.36 106.6,66.28 106.62,66.26 U$25.P10
N$23
  Bottom 0.254: R12.2 67.03,105.5 | 67.03,105.5 C11.2 | 67.03,105.5 67.51,107.41 69.95,107.75 70.69,106.22 U$26.P10
N$24  (via drill 0.35)
  Top 0.254: v103.96,71.4 105.31,73.46 105,74.52 | 105,74.52 arc31 v97.08,87.58 | v72.03,103.78 v73.61,106.83 | R15.2 105,74.52
  Bottom 0.254: U$25.P9 105.64,65.33 104.18,66.79 103.68,69.49 v103.96,71.4 | v97.08,87.58 87.09,95.98 84.99,96.55 76.83,101.24 76.07,101.24 72.39,103 v72.03,103.78 | v73.61,106.83 U$26.P14
NEOPIXEL
  Top 0.61: U$11.3 JP1.3
PHA_A  (via drill 0.35)
  Top 0.305: U$2.3 42.2,28.03 v36.7,33.53 | v46.48,86.74 45.47,87.76 U$1.P11
  Bottom 0.305: v36.7,33.53 30.61,39.62 30.61,72.52 36.59,78.5 55.75,78.5 56.52,79.26 56.52,84.58 54.36,86.74 v46.48,86.74
PHA_B  (via drill 0.35)
  Top 0.305: U$2.7 43.28,25.43 v34.67,34.04 | v51.09,85.76 48.01,88.84 U$1.P13
  Bottom 0.305: v34.67,34.04 29.72,38.99 29.72,72.64 36.32,79.25 55.24,79.25 55.88,79.88 55.88,84.07 54.1,85.85 51.18,85.85 v51.09,85.76
PWR1
  Top 1.905: U$17.P$2 U$17.P$1 arc19 U$8.2
  Bottom 1.905: B1.PWR1_2 arc60 B2.PWR1_1 B2.PWR1_2 arc60 B3.PWR1_1 | B1.PWR1_2 B1.PWR1_1 arc-60 B6.PWR1_2 B6.PWR1_1 arc-60 B5.PWR1_2 B5.PWR1_1 arc-60 B4.PWR1_2 B4.PWR1_1 arc-26 U$17.P$1 arc-7 U$17.P$2 arc-26 B3.PWR1_2 B3.PWR1_1 | B3.PWR1_1 | B3.PWR1_1 | B1.PWR1_2 arc-60 B1.PWR1_2
PWR2
  Top 1.905: U$19.P$1 U$19.P$2 arc-18 U$9.2
  Bottom 1.905: B2.PWR2_2 B2.PWR2_1 arc-60 B1.PWR2_2 B1.PWR2_1 arc-60 B6.PWR2_2 B6.PWR2_1 arc-26 U$19.P$1 arc-7 U$19.P$2 arc-26 B5.PWR2_2 B5.PWR2_1 arc-60 B4.PWR2_2 B4.PWR2_1 arc-60 B3.PWR2_2 35.89,20.96 B3.PWR2_1 arc-60 B2.PWR2_2
SC0  (via drill 0.35)
  Top 0.254: 38.02,9.96 44.2,7.37 51.05,5.71 58.04,5.21 64.01,5.71 69.98,6.73 74.47,7.85
  Top 0.305: 38.02,9.96 27.96,15.37 arc-23 v24.97,17.27 21.67,19.3 arc-51 7.19,49.15 v7.75,66.29 7.75,73.49 15.18,81.05 31.31,81.05 32.57,81.05 U$21.5 | 74.47,7.85 74.59,7.89 v76.71,8.69
  Bottom 0.305: B2.P4 5.28,64.59 v7.75,66.29 R4.1 | v24.97,17.27 25.65,15.37 25.78,15.24 B3.P4 | v76.71,8.69 B4.P4
SC1  (via drill 0.35)
  Top 0.305: U$21.8 37.85,83.57 39.12,84.84 39.12,102.11 37.34,103.89 v37.34,105.16 37.34,106.38 39.45,108.48 62.33,108.48 64.52,106.3 64.52,99.06 65.41,98.17 81.69,98.17 v83.44,101.09 | v98.3,89.28 100.33,86.61 arc-5 102.62,83.31 arc-14 105.92,76.33 arc-8 107.75,69.53 v107.75,55.91
  Bottom 0.305: v98.3,89.28 87.63,98.81 B6.P4 85.66,99.8 v83.44,101.09 | B1.P4 v37.34,105.16 40.64,107.06 45.97,106.93 R6.1 | B5.P4 108.51,54.74 107.77,55.48 107.77,55.88 v107.75,55.91
SCK
  Top 0.305: U$1.P23 60.7,89.66 63.12,87.25 63.12,83.95 63.37,83.69 U$11.7
SCL
  Top 0.305: U$21.1 37.04,89.88 37.84,90.68 U$1.P5
SD0  (via drill 0.35)
  Top 0.254: 44.7,6.5 52.83,4.7 59.05,4.57 66.8,5.33 v74.83,7.04
  Top 0.305: U$21.4 35.09,85.64 31.5,82.04 14.99,82.04 6.35,73.41 v6.35,63.88 6.35,50.16 arc56 v23.09,17.27 24.11,16.38 arc15 27.15,14.83 arc12 32.64,12.09 34.42,11.07 arc9 44.7,6.5
  Bottom 0.305: B2.P5 6.35,60.57 v6.35,63.88 R3.1 | v23.09,17.27 24.07,18.62 25.53,18.62 26.92,17.22 26.92,15.75 B3.P5 | v74.83,7.04 74.52,8.65 78.98,11.15 B4.P5
SD1  (via drill 0.35)
  Top 0.254: 99.48,86.32 arc-29 106.93,70.18 107.09,69.34 107.09,57.25 106.76,56.92 v106.76,56.26
  Top 0.305: U$21.7 36.39,82.61 36.7,82.3 39.75,82.3 41.66,84.2 41.66,92.33 41.66,101.73 41.66,102.74 v39.24,105.16 41.91,107.82 59.69,107.82 61.98,105.54 61.98,99.69 64.26,97.41 82.3,97.41 v83.82,99.82 | v97.03,88.77 99.48,86.32
  Bottom 0.305: v97.03,88.77 86.87,98.04 B6.P5 v83.82,99.82 | B1.P5 v39.24,105.16 R5.1 | v106.76,56.26 106.76,55.39 107.48,54.67 B5.P5
SDA
  Top 0.305: U$21.2 36.39,89.72 35.3,90.81 U$1.P3
SDO  (via drill 0.35)
  Top 0.254: U$1.P8 40.38,102.34 38.56,104.17 38.56,106.48 v39.47,107.39 | v18.16,93.22 17.14,92.2 17.14,89.24 R20.2
  Bottom 0.254: v39.47,107.39 32.92,103.45 32.38,101.54 30.32,100.4 28.63,100.97 23.95,98.35 22.15,98.78 21.92,98.78 18.59,96.53 18.59,94.56 18.97,94.18 | 18.97,94.18 19.85,94.18 20.65,95.22 U$7.P14 | 18.97,94.18 v18.16,93.22
SHCP  (via drill 0.35)
  Top 0.254: U$1.P18 53.09,104.47 v50.95,106.6 | v8.87,73.03 8.2,46.86 8.2,45.82 v8.41,44.22 arc13 10.67,36.7 11.05,35.74 arc17 19.91,22.45 22.05,20.32 25.83,17.78 35.81,11.89 41.17,9.37 v42.65,8.96 46.1,7.62 50.93,6.35 57.15,5.97 63.75,6.48 70.23,7.62 75.56,9.27 82.68,13.08 89.03,13.08 v91.01,19.43 | v107.37,50.32 106.1,51.59 v106.1,68.35
  Bottom 0.254: 13.64,87.96 15.15,91.42 18.01,91.42 U$7.P11 | 13.64,87.96 10.69,81.18 v8.87,73.03 | U$22.P11 6.95,44.41 7.16,44.2 v8.41,44.22 | v42.65,8.96 42.11,7.87 U$23.P11 | 13.64,87.96 17.55,86.36 21.14,90.73 25.68,94.03 27.15,95.58 33.91,99.52 34.16,100.15 36.55,101.5 43.41,103.83 45.31,104.47 45.49,104.5 48.13,105.18 v50.95,106.6 55.09,108.53 | U$24.P11 91.35,18.79 v91.01,19.43 98.78,24.66 103.86,35.38 104.88,37.72 arc23 v107.37,50.32 | v106.1,68.35 107.17,68.35 U$25.P11 | 55.09,108.53 58.55,110.14 70.36,108.38 71.37,106.43 U$26.P11 | R13.2 55.09,108.53
STCP  (via drill 0.35)
  Top 0.254: U$1.P16 50.55,105.03 v48.92,106.66
  Bottom 0.254: 47.22,108.41 48.92,106.7 v48.92,106.66 58.5,111.02 70.92,108.92 71.91,106.73 U$26.P12 | 47.22,108.41 39.37,108.41 32.56,103.78 32.08,102.09 30.31,101.09 28.5,101.42 23.9,98.91 21.87,99.31 17.88,96.6 16.87,92.3 | U$7.P12 18.46,92.33 18.46,92.3 17.99,92.3 16.87,92.3 | 3.1,43.08 2.67,44.53 1.8,49.2 4.29,51.13 4.42,55.14 5.54,55.98 5.54,57.73 4.48,58.49 4.47,68.88 14.39,92.3 16.87,92.3 | 3.1,43.08 5.77,43.18 6.45,43.86 U$22.P12 | 42.42,5.84 40.39,4.19 35.05,6.35 35.05,8.89 32.89,10.03 31.93,11 31.93,11.36 30.91,12.38 29.46,12.38 29.28,12.19 29.21,12.19 28.19,12.83 arc-42 4.42,38.96 3.83,40.74 3.1,43.08 | 42.42,5.84 42.42,7.11 U$23.P12 | 42.42,5.84 44.04,3.96 46.28,4.06 47.65,4.72 50.93,4.12 | 50.93,4.12 58.39,2.76 72.84,3.85 80.85,9.78 81.53,11.86 83.64,13.06 85.14,12.52 86.74,13.41 88.4,11.03 91.52,13.36 94.96,16.31 92.76,19.07 | 50.93,4.12 50.98,4.12 | 92.76,19.07 U$24.P12 | 92.76,19.07 99.26,24.23 105.11,36.09 arc23 108.36,48.59 108.36,49.99 109.63,51.26 109.63,55.19 108.92,55.91 108.92,58.09 109.68,58.85 109.68,59.66 112.29,62.28 110.92,69.42 107.67,69.42 U$25.P12 | 47.22,108.41 R14.2